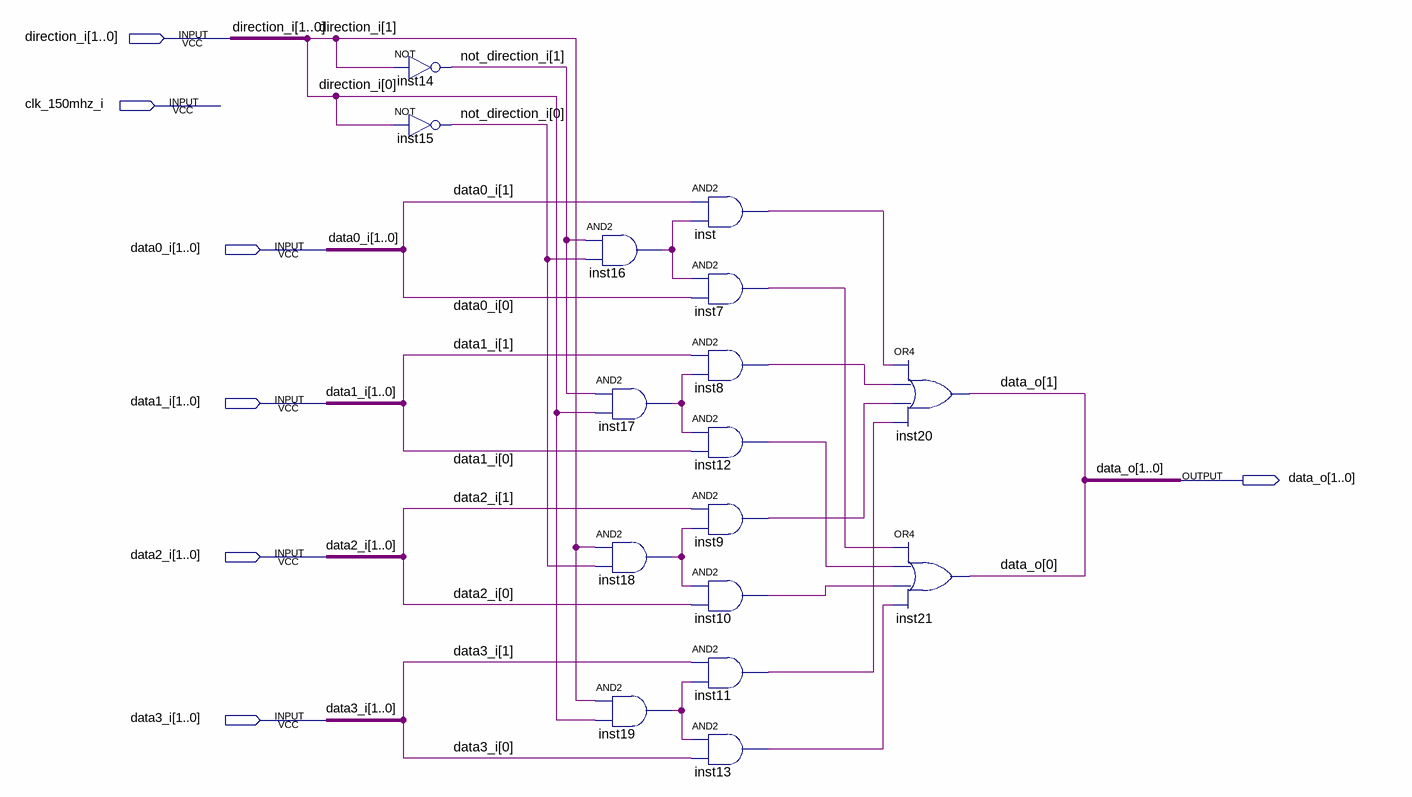
[diagram p0: schematic sheet]
// Quartus schematic lab_0.bdf as structural Verilog: 16 symbols, 7 pins
module lab_0 (
  input  [1:0] direction_i,
  input  clk_150mhz_i,
  input  [1:0] data0_i,
  input  [1:0] data1_i,
  input  [1:0] data2_i,
  input  [1:0] data3_i,
  output [1:0] data_o
);

  wire inst7_out, inst8_out, inst9_out, inst10_out, inst11_out, inst12_out, inst13_out, inst16_out,
       inst17_out, inst18_out, inst19_out, inst_out;
  wire [1:0] not_direction_i;

  not inst14 (not_direction_i[1], direction_i[1]);
  not inst15 (not_direction_i[0], direction_i[0]);
  and inst16 (inst16_out, not_direction_i[1], not_direction_i[0]);
  and inst17 (inst17_out, not_direction_i[1], direction_i[0]);
  and inst18 (inst18_out, direction_i[1], not_direction_i[0]);
  and inst19 (inst19_out, direction_i[1], direction_i[0]);
  and inst (inst_out, data0_i[1], inst16_out);
  and inst7 (inst7_out, inst16_out, data0_i[0]);
  and inst8 (inst8_out, data1_i[1], inst17_out);
  and inst12 (inst12_out, inst17_out, data1_i[0]);
  and inst9 (inst9_out, data2_i[1], inst18_out);
  and inst10 (inst10_out, inst18_out, data2_i[0]);
  and inst11 (inst11_out, data3_i[1], inst19_out);
  and inst13 (inst13_out, inst19_out, data3_i[0]);
  or inst20 (data_o[1], inst_out, inst8_out, inst9_out, inst11_out);
  or inst21 (data_o[0], inst7_out, inst12_out, inst10_out, inst13_out);
endmodule
